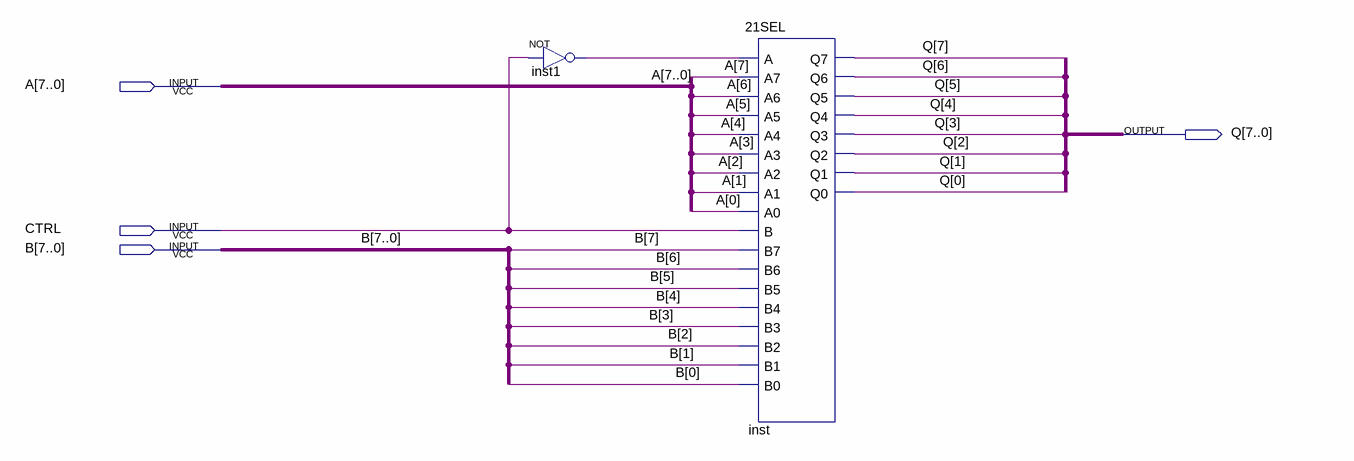
[diagram p0: schematic sheet]
// Quartus schematic SELRAM.bdf as structural Verilog: 2 symbols, 4 pins
module SELRAM (
  input  [7:0] A,
  input  CTRL,
  input  [7:0] B,
  output [7:0] Q
);

  wire inst1_out;

  not inst1 (inst1_out, CTRL);
  \21SEL  inst (
    .A(inst1_out), .A7(A[7]), .A6(A[6]), .A5(A[5]), .A4(A[4]), .A3(A[3]), .A2(A[2]), .A1(A[1]), .A0(A[0]),
    .B(CTRL), .B7(B[7]), .B6(B[6]), .B5(B[5]), .B4(B[4]), .B3(B[3]), .B2(B[2]), .B1(B[1]), .B0(B[0]),
    .Q7(Q[7]), .Q6(Q[6]), .Q5(Q[5]), .Q4(Q[4]), .Q3(Q[3]), .Q2(Q[2]), .Q1(Q[1]), .Q0(Q[0]));
endmodule
